# Altium schematic sheet Measurements.SchDoc
size A4
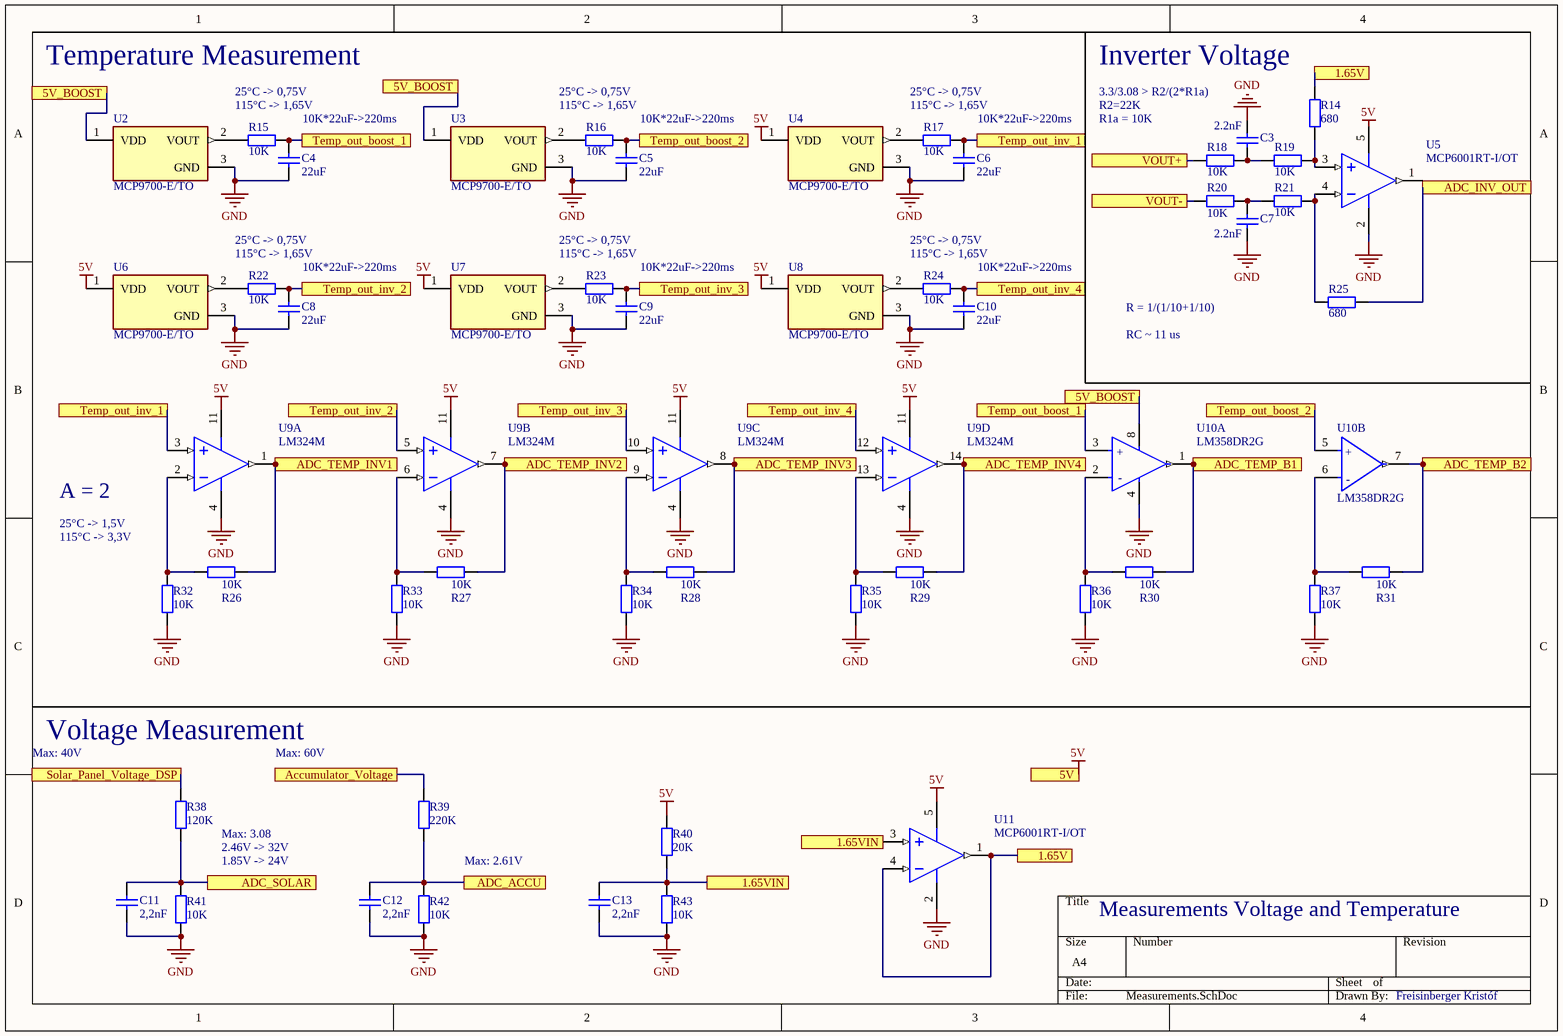
[diagram p0: Measurements.SchDoc]

## Parts
C3  2.2nF  [FP_0805_CAP_085]
C4  22uF  [FP_0805_CAP_085]
C5  22uF  [FP_0805_CAP_085]
C6  22uF  [FP_0805_CAP_085]
C7  2.2nF  [FP_0805_CAP_085]
C8  22uF  [FP_0805_CAP_085]
C9  22uF  [FP_0805_CAP_085]
C10  22uF  [FP_0805_CAP_085]
C11  2,2nF  [FP_0805_CAP_085]
C12  2,2nF  [FP_0805_CAP_085]
C13  2,2nF  [FP_0805_CAP_085]
R14  680  [FP_0805_RES]
R15  10K  [FP_0805_RES]
R16  10K  [FP_0805_RES]
R17  10K  [FP_0805_RES]
R18  10K  [FP_0805_RES]
R19  10K  [FP_0805_RES]
R20  10K  [FP_0805_RES]
R21  10K  [FP_0805_RES]
R22  10K  [FP_0805_RES]
R23  10K  [FP_0805_RES]
R24  10K  [FP_0805_RES]
R25  680  [FP_0805_RES]
R26  10K  [FP_0805_RES]
R27  10K  [FP_0805_RES]
R28  10K  [FP_0805_RES]
R29  10K  [FP_0805_RES]
R30  10K  [FP_0805_RES]
R31  10K  [FP_0805_RES]
R32  10K  [FP_0805_RES]
R33  10K  [FP_0805_RES]
R34  10K  [FP_0805_RES]
R35  10K  [FP_0805_RES]
R36  10K  [FP_0805_RES]
R37  10K  [FP_0805_RES]
R38  120K  [FP_0805_RES]
R39  220K  [FP_0805_RES]
R40  20K  [FP_0805_RES]
R41  10K  [FP_0805_RES]
R42  10K  [FP_0805_RES]
R43  10K  [FP_0805_RES]
U2  MCP9700-E/TO  [FP-C04-101-MFG]
U3  MCP9700-E/TO  [FP-C04-101-MFG]
U4  MCP9700-E/TO  [FP-C04-101-MFG]
U5  MCP6001RT-I/OT  [SOT-23-OT5_M]
U6  MCP9700-E/TO  [FP-C04-101-MFG]
U7  MCP9700-E/TO  [FP-C04-101-MFG]
U8  MCP9700-E/TO  [FP-C04-101-MFG]
U9  LM324M  [FP_SOIC14]  (parts A,B,C,D of 4)
U10  LM358DR2G  [FP-751-07-IPC_C]  (parts A,B of 2)
U11  MCP6001RT-I/OT  [SOT-23-OT5_M]

## Ports
1.65V, 1.65VIN, 5V, 5V_BOOST, Accumulator_Voltage, ADC_ACCU, ADC_INV_OUT, ADC_SOLAR, ADC_TEMP_B1, ADC_TEMP_B2, ADC_TEMP_INV1, ADC_TEMP_INV2, ADC_TEMP_INV3, ADC_TEMP_INV4, Solar_Panel_Voltage_DSP, Temp_out_boost_1, Temp_out_boost_2, Temp_out_inv_1, Temp_out_inv_2, Temp_out_inv_3, Temp_out_inv_4, VOUT+, VOUT-

## Nets
5V: R40.2 U4.1(VDD) U6.1(VDD) U7.1(VDD) U8.1(VDD) U9.11(GND) U11.5(VSS) ; port 5V
GND: C3.2 C4.1 C5.1 C6.1 C7.1 C8.1 C9.1 C10.1 C11.1 C12.1 C13.1 R32.1 R33.1 R34.1 R35.1 R36.1 R37.1 R41.1 R42.1 R43.1 U2.3(GND) U3.3(GND) U4.3(GND) U5.2(VDD) U6.3(GND) U7.3(GND) U8.3(GND) U9.4(V+) U10.4(VEE/GND) U11.2(VDD)
1.65V: R14.2 U11.1(VOUT) U11.4(VIN-) ; port 1.65V
1.65VIN: C13.2 R40.1 R43.2 U11.3(VIN+) ; port 1.65VIN
5V_BOOST: U2.1(VDD) U3.1(VDD) U10.8(VCC) ; port 5V_BOOST
Accumulator_Voltage: R39.2 ; port Accumulator_Voltage
ADC_ACCU: C12.2 R39.1 R42.2 ; port ADC_ACCU
ADC_INV_OUT: R25.2 ; port ADC_INV_OUT
ADC_SOLAR: C11.2 R38.1 R41.2 ; port ADC_SOLAR
ADC_TEMP_B1: R30.1 U10.1(OUTPUT_A) ; port ADC_TEMP_B1
ADC_TEMP_B2: R31.1 U10.7(OUTPUT_B) ; port ADC_TEMP_B2
ADC_TEMP_INV1: R26.1 U9.1(OUT1) ; port ADC_TEMP_INV1
ADC_TEMP_INV2: R27.1 U9.7(OUT2) ; port ADC_TEMP_INV2
ADC_TEMP_INV3: R28.1 U9.8(OUT3) ; port ADC_TEMP_INV3
ADC_TEMP_INV4: R29.1 U9.14(OUT4) ; port ADC_TEMP_INV4
Solar_Panel_Voltage_DSP: R38.2 ; port Solar_Panel_Voltage_DSP
Temp_out_boost_1: C4.2 R15.2 U10.3(INPUT_A+) ; port Temp_out_boost_1
Temp_out_boost_2: C5.2 R16.2 U10.5(INPUT_B+) ; port Temp_out_boost_2
Temp_out_inv_1: C6.2 R17.2 U9.3(IN1+) ; port Temp_out_inv_1
Temp_out_inv_2: C8.2 R22.2 U9.5(IN2+) ; port Temp_out_inv_2
Temp_out_inv_3: C9.2 R23.2 U9.10(IN3+) ; port Temp_out_inv_3
Temp_out_inv_4: C10.2 R24.2 U9.12(IN4+) ; port Temp_out_inv_4
VOUT+: R18.1 ; port VOUT+
VOUT-: R20.1 ; port VOUT-
NetC3_1: C3.1 R18.2 R19.1
NetC7_2: C7.2 R20.2 R21.1
NetR14_1: R14.1 R19.2 U5.3(VIN+)
NetR15_1: R15.1 U2.2(VOUT)
NetR16_1: R16.1 U3.2(VOUT)
NetR17_1: R17.1 U4.2(VOUT)
NetR21_2: R21.2 R25.1 U5.4(VIN-)
NetR22_1: R22.1 U6.2(VOUT)
NetR23_1: R23.1 U7.2(VOUT)
NetR24_1: R24.1 U8.2(VOUT)
NetR26_2: R26.2 R32.2 U9.2(IN1-)
NetR27_2: R27.2 R33.2 U9.6(IN2-)
NetR28_2: R28.2 R34.2 U9.9(IN3-)
NetR29_2: R29.2 R35.2 U9.13(IN4-)
NetR30_2: R30.2 R36.2 U10.2(INPUT_A-)
NetR31_2: R31.2 R37.2 U10.6(INPUT_B-)

Not connected (* = marked no-connect by the designer): U5 1(VOUT) 5(VSS)

## Notes on the sheet
- Temperature Measurement
- 115°C -> 1,65V
- 25°C -> 0,75V
- 3.3/3.08 > R2/(2*R1a)
- (near R14) Inverter Voltage
- R2=22K
- 10K*22uF->220ms
- R1a = 10K
- R = 1/(1/10+1/10)
- RC ~ 11 us
- A = 2
- 115°C -> 3,3V
- 25°C -> 1,5V
- Max: 40V
- Voltage Measurement
- Max: 60V
- 2.46V -> 32V
- (near R38) Max: 3.08
- 1.85V -> 24V
- Max: 2.61V
- Measurements Voltage and Temperature
- Freisinberger Kristóf
- Labels drawn without touching a wire or pin: 5V
- (in symbol CMP-1310-00291-2, part A) +; -
- (in symbol CMP-1310-00291-2, part B) +; -

## Library data of the parts
C3-C13 = CAP: Capacitor
  C3 C7: Value: 2.2nF
  C4-C6 C8-C10: Value: 22uF
  C11-C13: Value: 2,2nF
R14-R43 = RES: Resistor
  R14 R25: Value: 680
  R15-R24 R26-R37 R41-R43: Value: 10K
  R38: Value: 120K
  R39: Value: 220K
  R40: Value: 20K
U2-U4 U6-U8 = CMP-0192-00001-2: SENSOR ANALOG -40C-125C TO92-3; Manufacturer: Microchip; Output Current: 100uA; Sensor Output: Analog Voltage; Output Voltage: 500mV; Max Supply Voltage: 5.5V; Import Ts: 1521170835; Min Supply Voltage: 2.3V; Operating Supply Current: 6uA; Max Junction Temp: +150°C; RoHS: TRUE; Height: 5.334mm; Manufacturer Part Number: MCP9700-E/TO; Ipc Land Pattern Name: TO-92; Digikey Description: SENSOR ANALOG -40C-125C TO92-3; Device Class L1: Sensors; Footprint Url: http://ww1.microchip.com/downloads/en/DeviceDoc/3L_TO-92%20Plastic%20Transistor%20Outline_TO_C04-00101c.pdf; Automotive: No; Mouser Description: Board Mount Temperature Sensors Lin Active Therm; ComponentLink2Description: Datasheet; Device Class L2: Temperature and Humidity Sensors; Ambient Temperature Range Low: -40°C; Package: C04-101; Device Class L3: unset; Temperature: -40°C to +125°C; Ambient Temperature Range High: +125°C; Temperature Range High: +125°C; Lead Free: Yes; Category: IC; ComponentLink2URL: http://ww1.microchip.com/downloads/en/DeviceDoc/20001942G.pdf; Temperature Range Low: -40°C; Octopart: https://octopart.com/mcp9700-e%2Fto-microchip-668812
U5 U11 = CMP-0187-00469-2: 1 MHz, Low-Power Operational Amplifier, 5-Pin SOT-23, Industrial Temperature, Tape and Reel; ComponentLink1URL: http://www.microchip.com/; DatasheetVersion: revJ, Nov-2009; PackageVersion: revBB, Aug-2009; RevisionNote: URLs added.; ComponentLink1Description: Manufacturer URL; PackageReference: SOT-23-OT5; ComponentLink3Description: Package Specification; ComponentLink2Description: Datasheet; ComponentLink2URL: http://ww1.microchip.com/downloads/en/DeviceDoc/21733j.pdf; ComponentLink3URL: http://www.microchip.com/stellent/groups/techpub_sg/documents/packagingspec/en012702.pdf; PackageDescription: 5-Lead Plastic Small Outline Transistor (OT) [SOT-23]; Code_IPC: SOT23-5
U9 = LM324M: Low Power Quad Operational Amplifier, 14-pin Narrow SOIC; Code_JEDEC: MS-012AB; Code_IPC: SOIC127P600-14; ComponentLink1Description: LM324 Datasheet; ComponentLink1URL: http://www.national.com/ds/LM/LM324.pdf; ComponentLink2Description: LM324 Web Page; ComponentLink2URL: http://www.national.com/pf/LM/LM324.html; ComponentLink3Description: M14A Package Page; ComponentLink3URL: http://www.national.com/packaging/folders/m14a.html
U10 = CMP-1310-00291-2: IC OPAMP GP 2 CIRCUIT 8SOIC; Gain Bandwidth Product: 1MHz; Number of Circuits: 2; Min Supply Voltage: 3V; Slew Rate: 0.6V/µs; Max Dual Supply Voltage: 16V; Common Mode Rejection Ratio: 65dB; Input Bias Current: 250nA; Min Dual Supply Voltage: 1.5V; Dual Supply Voltage: 9V; Operating Supply Current: 1.5mA; Output Current: 40mA; Input Offset Voltage (Vos): 7mV; Nominal Supply Current: 1.2mA; Voltage Gain: 100dB; Max Supply Voltage: 32V; Width: 4mm; Number of Pins: 8; Min Operating Temperature: 0°C; REACH SVHC: No SVHC; Contact Plating: Tin; Lead Free: Lead Free; Halogen Free: Halogen Free; Power Supply Rejection Ratio (PSRR): 65dB; Operating Supply Voltage: 16V; Package Quantity: 2500; Max Operating Temperature: 70°C; Case/Package: SOIC; Height: 1.5mm; Packaging: Tape and Reel; Radiation Hardening: No; Number of Channels: 2; Bandwidth: 1MHz; Length: 5mm; Number of Elements: 2; Number of Amplifiers: 2; Output Current per Channel: 40mA